# EAGLE schematic logger (EAGLE 7.7.0)
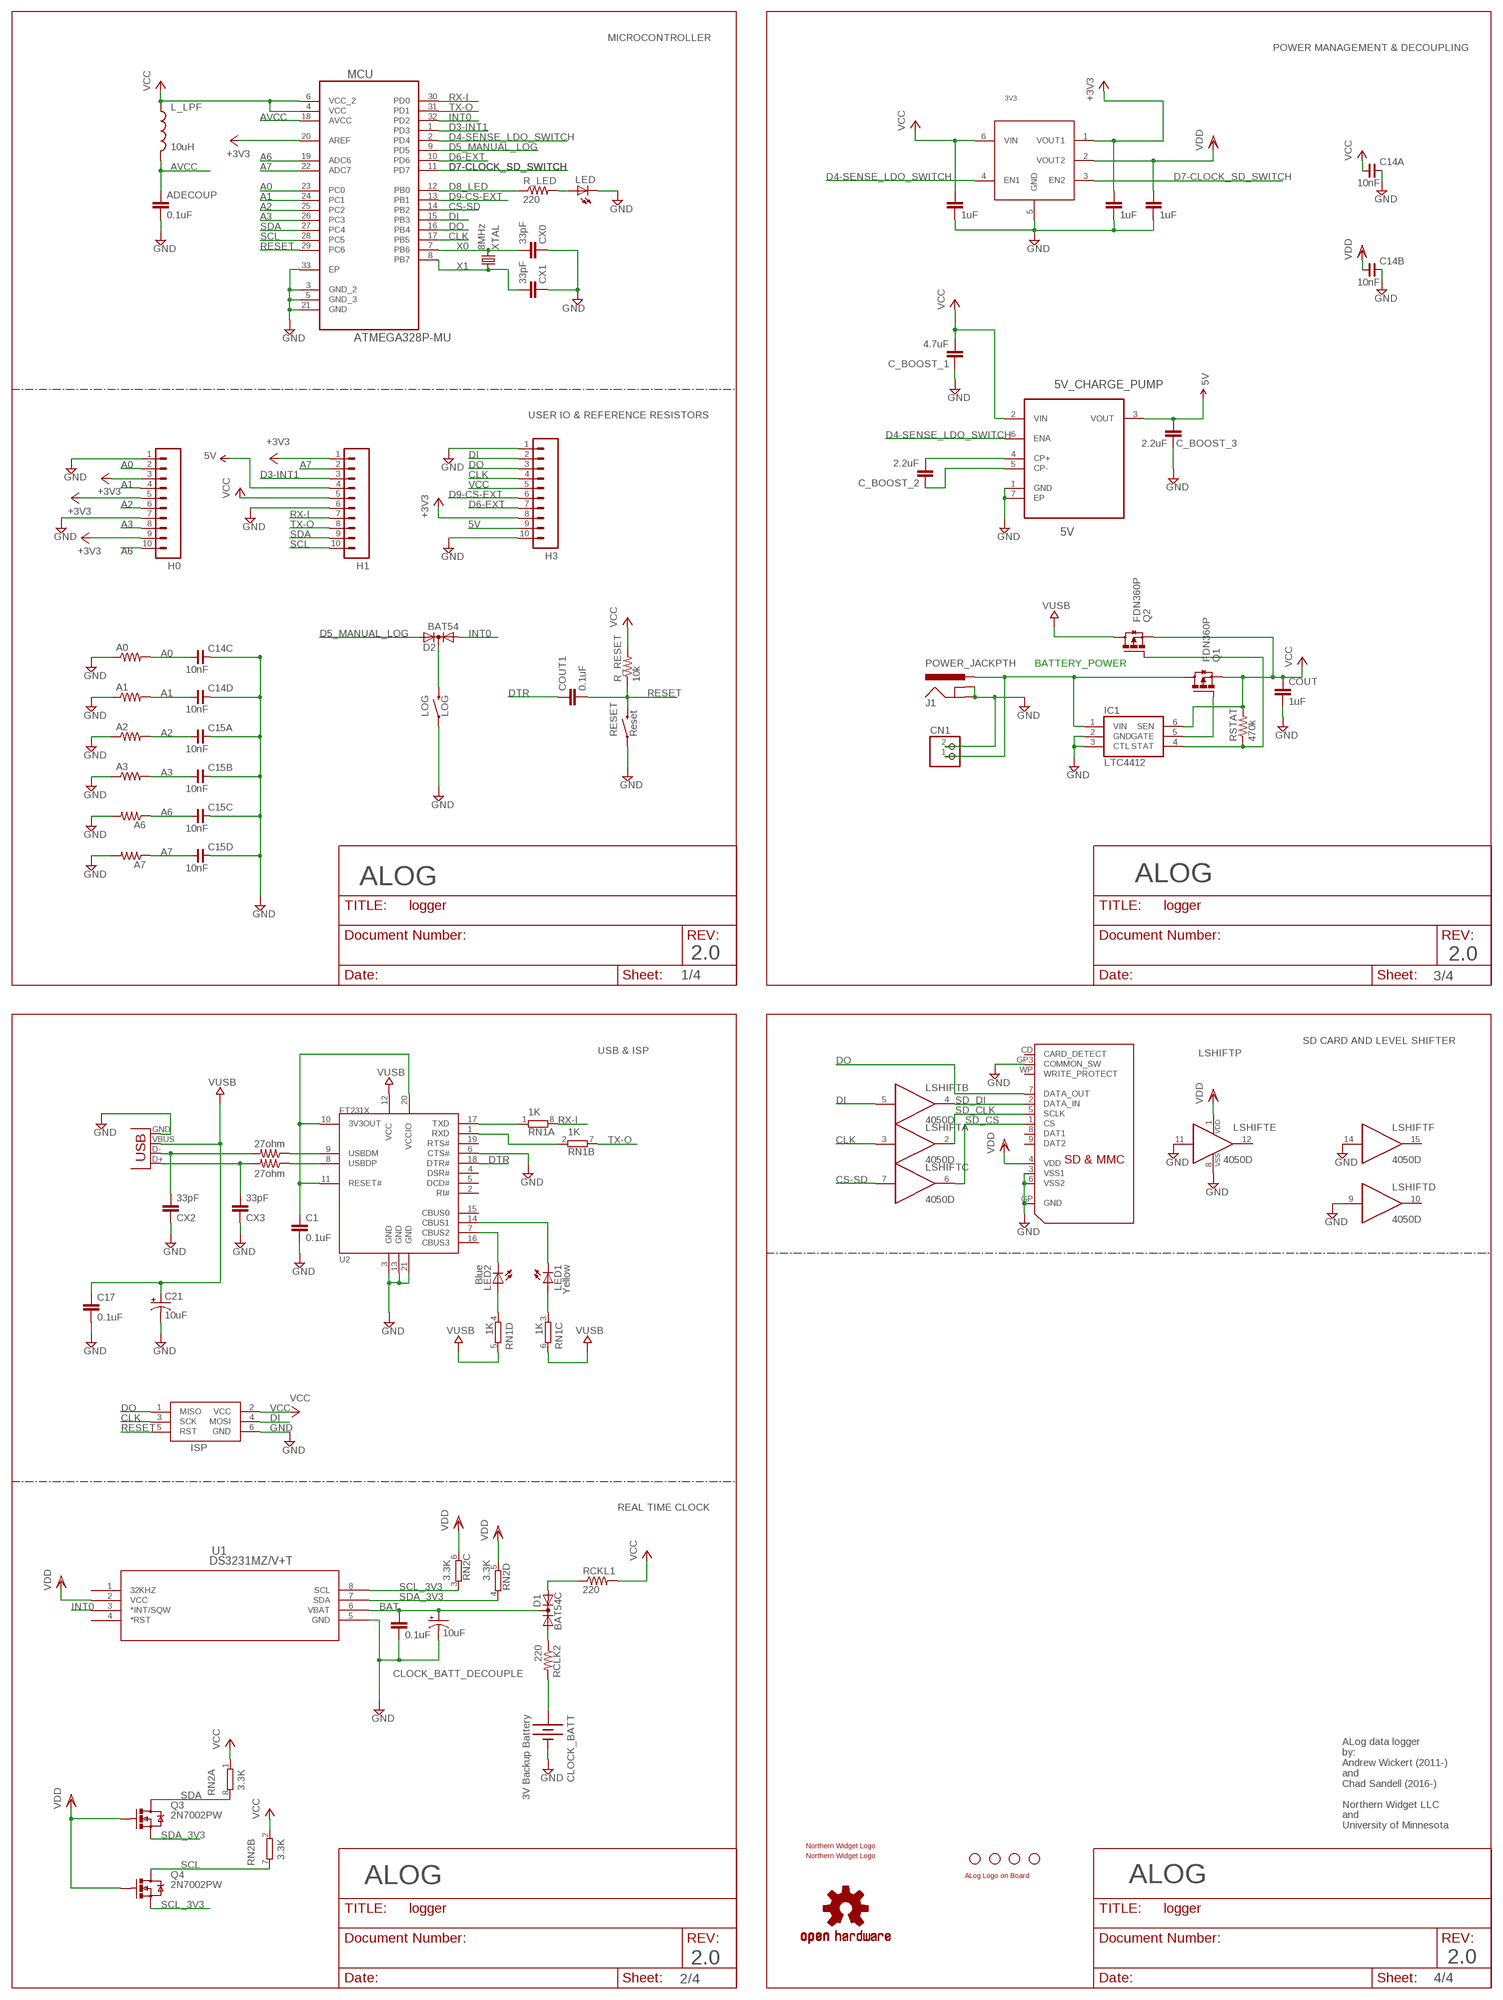
[diagram p0: schematic, sheet 1]

## Parts
3V3  MIC5380  [6-TMLF]
5V_CHARGE_PUMP  5V  TPS60150DRVR  [SON65P200X200X80-7N]
A0  R-US_0207/10  [0207/10]
A1  R-US_0207/10  [0207/10]
A2  R-US_0207/10  [0207/10]
A3  R-US_0207/10  [0207/10]
A6  R-US_0207/10  [0207/10]
A7  R-US_0207/10  [0207/10]
ADECOUP  0.1uF  C-EUC0603  [C0603]
C1  0.1uF  C-EUC0603  [C0603]
C14  10nF  CCA_ECJ-1206  [CECJ-1206]
C15  10nF  CCA_ECJ-1206  [CECJ-1206]
C17  0.1uF  C-EUC0603  [C0603]
C21  10uF  CAP_POL1206  [EIA3216]
C_BOOST_1  4.7uF  C-EUC0603  [C0603]
C_BOOST_2  2.2uF  C-EUC0603  [C0603]
C_BOOST_3  2.2uF  C-EUC0603  [C0603]
CLOCK_BATT  3V Backup Battery  BATTERY12PTH  [BATTCON_12MM_PTH]
CLOCK_BATT_DECOUP  0.1uF  C-EUC0603  [C0603]
CLOCK_BATT_DECOUPLE  10uF  CAP_POL1206  [EIA3216]
CLOCK_CIN1  1uF  C-EUC0603  [C0603]
CLOCK_CIN2  1uF  C-EUC0603  [C0603]
CLOCK_CIN3  1uF  C-EUC0603  [C0603]
CN1  JST_2PIN-THM  [JST-PH-2-THM]
COUT  1uF  C-EUC0603  [C0603]
COUT1  0.1uF  C-EUC0603  [C0603]
CX0  33pF  C-EUC0603  [C0603]
CX1  33pF  C-EUC0603  [C0603]
CX2  33pF  C-EUC0603  [C0603]
CX3  33pF  C-EUC0603  [C0603]
D1  BAT54C  DIODE_AC-CA_  [SOT23C]
D2  BAT54  DIODE_AC-CA_  [SOT23C]
D+  27ohm  R-US_R0603  [R0603]
D-  27ohm  R-US_R0603  [R0603]
H0  M10-3.5MM  [SCREWTERMINAL-3.5MM-8]
H1  M10-3.5MM  [SCREWTERMINAL-3.5MM-8]
H3  M10-3.5MM  [SCREWTERMINAL-3.5MM-8]
IC1  LTC4412  LTC4412ES6  [TSOT23-6]
ISP  AVRISP-6  [AVRISP]
J1  POWER_JACKPTH  [POWER_JACK_PTH]
JP1  STAND-OFF  [STAND-OFF]
JP2  STAND-OFF  [STAND-OFF]
JP3  STAND-OFF  [STAND-OFF]
JP4  STAND-OFF  [STAND-OFF]
JP5  USB-B  USBPTH  [USB-B-PTH]
L_LPF  10uH  INDUCTOR0805  [0805]
LED  LED3MM  [LED3MM]
LED1  Yellow  LED0603  [LED-0603]
LED2  Blue  LED0603  [LED-0603]
LOG  LOG  SWITCH-MOMENTARY-2PTH  [TACTILE-PTH]
LOGO1  OSHW-LOGOM  [OSHW-LOGO-M]
LSHIFT  4050D  [SO16]
MCU  ATMEGA328P-MU  [QFN50P500X500X100-33N]
Q1  FDN360P  [SUPER-SOT3]
Q2  FDN360P  [SUPER-SOT3]
Q3  2N7002PW  MOSFET-NCHANNELSOT323  [SOT323]
Q4  2N7002PW  MOSFET-NCHANNELSOT323  [SOT323]
R_LED  220  R-US_R0603  [R0603]
R_RESET  10k  R-US_R0603  [R0603]
RCKL1  220  R-US_R0603  [R0603]
RCLK2  220  R-US_R0603  [R0603]
RESET  Reset  SWITCH-MOMENTARY-2PTH  [TACTILE-PTH]
RN1  1K  4R-N0603-ARC  [0603-ARC]
RN2  3.3K  4R-N0603-ARC  [0603-ARC]
RSTAT  470k  R-US_R0603  [R0603]
SD  SDMMC06132  [06132]
U1  DS3231MZ/V+T  [21-0041B_8]
U2  FT231X-Q  [QFN20]
U$1  NWLOGO  [NWLOGO]
U$2  ALOG_LOGO_V1_5.5MM  [ALOG_LOGO_V1_SMALL]
U$3  NWLOGO_MED  [NWLOGO_MED]
XTAL  8MHz  CRYSTALHC49UV  [HC49U-V]

## Nets
5V: 5V_CHARGE_PUMP.3(VOUT) C_BOOST_3.2 H1.4 H3.9
+3V3: 3V3.1(VOUT1) CLOCK_CIN2.1 H0.3 H0.5 H0.9 H1.1 H3.8 MCU.20(AREF)
A0: A0.2 C14.C1 H0.2 MCU.23(PC0)
A1: A1.2 C14.D1 H0.4 MCU.24(PC1)
A2: A2.2 C15.A1 H0.6 MCU.25(PC2)
A3: A3.2 C15.B1 H0.8 MCU.26(PC3)
A6: A6.1 C15.C1 H0.10 MCU.19(ADC6)
A7: A7.1 C15.D1 H1.2 MCU.22(ADC7)
AVCC: ADECOUP.1 L_LPF.2 MCU.18(AVCC)
BAT: CLOCK_BATT_DECOUP.1 CLOCK_BATT_DECOUPLE.A(+) D1.3(K) U1.6(VBAT)
CLK: H3.4 ISP.3(SCK) LSHIFT.3(A:I) MCU.17(PB5)
CS-SD: LSHIFT.7(C:I) MCU.14(PB2)
D3-INT1: H1.3 MCU.1(PD3)
D4-SENSE_LDO_SWITCH: 3V3.4(EN1) 5V_CHARGE_PUMP.6(ENA) MCU.2(PD4)
D5_MANUAL_LOG: D2.2(A2) MCU.9(PD5)
D6-EXT: H3.7 MCU.10(PD6)
D7-CLOCK_SD_SWITCH: 3V3.3(EN2) MCU.11(PD7)
D8_LED: MCU.12(PB0) R_LED.1
D9-CS-EXT: H3.6 MCU.13(PB1)
DI: H3.2 ISP.4(MOSI) LSHIFT.5(B:I) MCU.15(PB3)
DO: H3.3 ISP.1(MISO) MCU.16(PB4) SD.7(DATA_OUT)
DTR: COUT1.1 U2.18(DTR#)
GND: 3V3.5(GND) 5V_CHARGE_PUMP.1(GND) 5V_CHARGE_PUMP.7(EP) A0.1 A1.1 A2.1 A3.1 A6.2 A7.2 ADECOUP.2 C1.2 C14.A2 C14.B2 C14.C2 C14.D2 C15.A2 C15.B2 C15.C2 C15.D2 C17.2 C21.C(-) C_BOOST_1.1 C_BOOST_3.1 CLOCK_BATT.GND(-) CLOCK_BATT_DECOUP.2 CLOCK_BATT_DECOUPLE.C(-) CLOCK_CIN1.2 CLOCK_CIN2.2 CLOCK_CIN3.2 CN1.2 COUT.2 CX0.1 CX1.1 CX2.1 CX3.1 H0.1 H0.7 H1.6 H3.1 H3.10 IC1.2(GND) IC1.3(CTL) ISP.6(GND) J1.GND J1.GNDBREAK JP5.GND LED.K(C) LOG.1 LSHIFT.8(P:VSS) LSHIFT.9(D:I) LSHIFT.11(E:I) LSHIFT.14(F:I) MCU.3(GND_2) MCU.5(GND_3) MCU.21(GND) MCU.33(EP) RESET.1 SD.3(VSS1) SD.6(VSS2) SD.GP3(COMMON_SW) SD.GP(GND) U1.5(GND) U2.3(GND) U2.6(CTS#) U2.13(GND) U2.21(GND)
INT0: D2.1(A1) MCU.32(PD2) U1.3(*INT/SQW)
LED+: LED.A R_LED.2
N$1: D1.1(A1) RCLK2.1
N$2: CLOCK_BATT.VCC@1(+) RCLK2.2
N$3: CX3.2 D+.2 JP5.D+
N$4: CX2.2 D-.2 JP5.D-
N$5: LED2.A RN1.4
N$6: LED2.C U2.7(CBUS2)
N$7: IC1.4(STAT) Q2.1(G) RSTAT.1
N$8: IC1.5(GATE) Q1.1(G)
N$9: LED1.A RN1.3
N$10: LED1.C U2.14(CBUS1)
N$11: D2.3(K) LOG.3
N$13: D-.1 U2.9(USBDM)
N$14: 5V_CHARGE_PUMP.4(CP+) C_BOOST_2.2
N$15: 5V_CHARGE_PUMP.5(CP-) C_BOOST_2.1
N$16: D+.1 U2.8(USBDP)
N$17: C1.1 U2.10(3V3OUT) U2.11(RESET#) U2.20(VCCIO)
N$27: RN1.1 U2.17(TXD)
N$29: RN1.2 U2.1(RXD)
N$67: D1.2(A2) RCKL1.1
RESET: COUT1.2 ISP.5(RST) MCU.29(PC6) R_RESET.1 RESET.3
RX-I: H1.7 MCU.30(PD0) RN1.8
SCL: H1.10 MCU.28(PC5) Q4.3(D) RN2.7
SCL_3V3: Q4.2(S) RN2.3 U1.8(SCL)
SD_CLK: LSHIFT.2(A:O) SD.5(SCLK)
SD_CS: LSHIFT.6(C:O) SD.1(CS)
SD_DI: LSHIFT.4(B:O) SD.2(DATA_IN)
SDA: H1.9 MCU.27(PC4) Q3.3(D) RN2.8
SDA_3V3: Q3.2(S) RN2.4 U1.7(SDA)
TX-O: H1.8 MCU.31(PD1) RN1.7
VBAT: CN1.1 IC1.1(VIN) J1.PWR Q1.3(D)
VCC: 3V3.6(VIN) 5V_CHARGE_PUMP.2(VIN) C14.A1 C_BOOST_1.2 CLOCK_CIN1.1 COUT.1 H1.5 H3.5 IC1.6(SEN) ISP.2(VCC) L_LPF.1 MCU.4(VCC) MCU.6(VCC_2) Q1.2(S) Q2.2(S) R_RESET.2 RCKL1.2 RN2.1 RN2.2 RSTAT.2
VDD: 3V3.2(VOUT2) C14.B1 CLOCK_CIN3.1 LSHIFT.1(P:VDD) Q3.1(G) Q4.1(G) RN2.5 RN2.6 SD.4(VDD) U1.2(VCC)
VUSB: C17.1 C21.A(+) JP5.VBUS Q2.3(D) RN1.5 RN1.6 U2.12(VCC)
X0: CX0.2 MCU.7(PB6) XTAL.2
X1: CX1.2 MCU.8(PB7) XTAL.1
Unconnected: LSHIFT.10(D:O) LSHIFT.12(E:O) LSHIFT.15(F:O) SD.8(DAT1) SD.9(DAT2) SD.CD(CARD_DETECT) SD.WP(WRITE_PROTECT) U1.1(32KHZ) U1.4(*RST) U2.2(RI#) U2.4(DSR#) U2.5(DCD#) U2.15(CBUS0) U2.16(CBUS3) U2.19(RTS#)

## Notes on the sheet
- MICROCONTROLLER
- POWER MANAGEMENT & DECOUPLING
- USER IO & REFERENCE RESISTORS
- BATTERY_POWER
- ALOG | ALOG
- 2.0 | 2.0
- 1/4 | 3/4
- SD CARD AND LEVEL SHIFTER
- USB & ISP
- REAL TIME CLOCK
- ALog data logger
  by:
  Andrew Wickert (2011-)
  and
  Chad Sandell (2016-)
  
  Northern Widget LLC
  and
  University of Minnesota
- ALOG | ALOG
- 2.0 | 2.0
- 2/4 | 4/4

## Library data of the parts
3V3 = csandell:MIC5380: Duel 3.3V Low drop out regulator. Digikey: 576-3453-1-ND
5V_CHARGE_PUMP = ti_by_element14:TPS60150DRVR: Charge Pump Device; MPN: TPS60150DRVR; OC_FARNELL: -; OC_NEWARK: 45P8283; PACKAGE: SON-6; SUPPLIER: Texas Instruments
A0 A1-A3 A6 A7 R_LED = resistor:R-US_: RESISTOR, American symbol
ADECOUP C1 C17 C_BOOST_1-C_BOOST_3 CX0 CX1-CX3 = resistor:C-EU: CAPACITOR, European symbol
C14 C15 = rc-master-smd:CCA_: CHIP CAP ARRAY
C21 CLOCK_BATT_DECOUPLE = SparkFun-Passives:CAP_POL: Capacitor Polarized These are standard SMD and PTH capacitors. Normally 10uF, 47uF, and 100uF in electrolytic and tantalum varieties. Always verify the external diameter of the through hole cap, it varies with capacity, voltage, and manufacturer. The EIA devices should be standard.
CLOCK_BATT = SparkFun:BATTERY: Battery Holders Various common sizes : AA, AAA, 20mm coin cell and 12mm coin cell.
CLOCK_BATT_DECOUP CLOCK_CIN1-CLOCK_CIN3 COUT COUT1 = rcl:C-EU: CAPACITOR, European symbol
CN1 = adafruit:JST_2PIN: JST 2-Pin Connectors of various flavors SMT-RA (S2B-PH-SM4) 4UConnector #17311 SMT (B2B-PH-SM4) THM-RA (S2B-PH) THM (B2B-PH)
D1 D2 = semicon-smd-ipc:DIODE_AC-CA_: DUAL DIODE
D+ D- R_RESET RCKL1 RCLK2 RSTAT = rcl:R-US_: RESISTOR, American symbol
H0 H1 H3 = SparkFun-Connectors:M10-3.5MM
IC1 = awickert:LTC4412*: Low Loss PowerPath Controller
ISP = adafruit:AVRISP: AVR ISP HEADER Standard 6 pin header for AVR programming
J1 = SparkFun:POWER_JACK: Power Jack This is the standard 5.5mm barrel jack for power. The PTH is the most common, proven, reliable, footprint. All others are experimental. The Slot footprint only works if the mill layer is transmitted to the PCB fab house so be warned. Spark Fun Electronics SKU : PRT-00119. Mating wall wart : TOL-00298 (and others)
JP1-JP4 = SparkFun:STAND-OFF: Stand Off This is the mechanical footprint for a #4 phillips button head screw. Use the keepout ring to avoid running the screw head into surrounding components. SKU : PRT-00447
JP5 = SparkFun-Connectors:USB: USB Connectors USB-B-PTH is fully proven SKU : PRT-00139/CONN-08278 USB-miniB is fully proven SKU : PRT-00587 USB-A-PCB is untested. USB-A-H is throughly reviewed, but untested. Spark Fun Electronics SKU : PRT-00437 USB-B-SMT is throughly reviewed, but untested. Needs silkscreen touching up. USB-A-S has not been used/tested USB-MB-H has not been used/tested USB-MICROB has been used. CONN-09505; PROD_ID: CONN-08278
L_LPF = SparkFun:INDUCTOR: Inductors Basic Inductor/Choke - 0603 and 1206. Footprints are not proven and vary greatly between part numbers.
LED = SparkFun:LED: LEDs Standard schematic elements and footprints for 5mm, 3mm, 1206, and 0603 sized LEDs. 5mm - Spark Fun Electronics SKU : COM-00529 (and others)
LED1 LED2 = SparkFun-LED:LED: LEDs Standard schematic elements and footprints for 5mm, 3mm, 1206, and 0603 sized LEDs. 5mm - Spark Fun Electronics SKU : COM-00529 (and others)
LOG RESET = SparkFun-Electromechanical:SWITCH-MOMENTARY-2: Various NO switches- pushbuttons, reed, etc; PROD_ID: SWCH-08441
LOGO1 = SparkFun-Aesthetics:OSHW-LOGO: Open Source Hardware Logo This logo indicates the piece of hardware it is found on incorporates a OSHW license and/or adheres to the definition of open source hardware found here: http://freedomdefined.org/OSHW
LSHIFT = 40xx:4050: Hex non-inverting BUFFER
MCU = Atmel_By_element14_Batch_1-00:ATMEGA328P-MU: Programmable Flash; MPN: ATMEGA328P-MU; OC_FARNELL: 1748522; OC_NEWARK: 26R2526; PACKAGE: QFN-32; SUPPLIER: Atmel
Q1 Q2 = transistor-power:FDN360P: Single P-Channel, PowerTrench (R) MOSFET Source: http://www.fairchildsemi.com/ds/FD/FDN360P.pdf
Q3 Q4 = SparkFun-DiscreteSemi:MOSFET-NCHANNEL: Generic NMOS footprint
RN1 RN2 = resistor-dil:4R-N: Array Chip Resistor Source: RS Component / Phycomp; OC_FARNELL: unknown; OC_NEWARK: unknown
SD = adafruit:SDMMC: SD MMC Card holder 4UCON part #06132 - easy to solder
U1 = Maxim-DS3231MZ_8-SOIC:DS3231MZ/V+T; MANUFACTURER_NAME: Maxim; MANUFACTURER_PART_NUMBER: DS3231MZ/V+T; VENDOR: Maxim
U2 = FT231X:FT231X
U$1 = awickert:NWLOGO
U$2 = awickert:ALOG_LOGO_V1_5.5MM
U$3 = awickert:NWLOGO_MED: Medium-sized Northern Widget logo
XTAL = SparkFun:CRYSTAL: Crystals Various standard crystals. Proven footprints. Spark Fun Electronics SKU : COM-00534

## Net classes
0 default: width 0.203 mm, drill 0.305 mm
1 power: width 0.305 mm, drill 0.508 mm
2 gnd: width 0.61 mm, drill 0.508 mm, clearance 0.203 mm
3 usbvcc: width 0.508 mm, drill 0.508 mm, clearance 0.152 mm
4 aref: width 0.406 mm